# Altium project DCFv2.PrjPcb
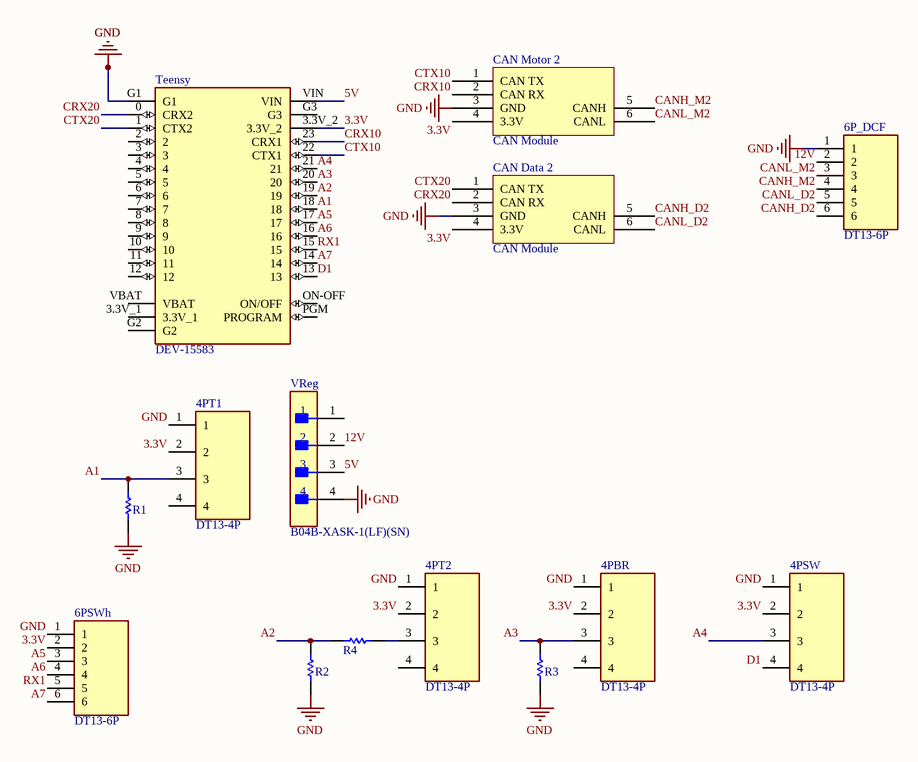
[diagram p0: DCFv2.SchDoc]
1 sheet, 14 parts. Net scope: global (net labels, ports and power ports of the same name join across sheets).
Board file: DCFv2.PcbDoc

## Sheet DCFv2.SchDoc
size A; SheetNumber: 1; SheetTotal: 1

### Parts
4PBR  DT13-4P  [TE_DT13-4P]
4PSW  DT13-4P  [TE_DT13-4P]
4PT1  DT13-4P  [TE_DT13-4P]
4PT2  DT13-4P  [TE_DT13-4P]
6P_DCF  DT13-6P  [TE_DT13-6P]
6PSWh  DT13-6P  [TE_DT13-6P]
CAN_Data_2  CAN Module  [CAN Module-Footprint-1]
CAN_Motor_2  CAN Module  [CAN Module-Footprint-1]
R1  MFR-25FBF5210K  [RESA60-630X240]  (value not drawn)
R2  MFR-25FBF5210K  [RESA60-630X240]  (value not drawn)
R3  MFR-25FBF5210K  [RESA60-630X240]  (value not drawn)
R4  MFR-25FBF5210K  [RESA60-630X240]  (value not drawn)
Teensy  DEV-15583  [MODULE_DEV-15583]
VReg  B04B-XASK-1(LF)(SN)  [FP-B04B-XASK-1_LF_SN-MFG]

### Nets
GND: 4PBR.1 4PSW.1 4PT1.1 4PT2.1 6P_DCF.1 6PSWh.1 CAN_Data_2.3(GND) CAN_Motor_2.3(GND) R1.1 R2.1 R3.1 Teensy.G1 VReg.4
3.3V: 4PBR.2 4PSW.2 4PT1.2 4PT2.2 6PSWh.2 CAN_Data_2.4(3.3V) CAN_Motor_2.4(3.3V) Teensy.3.3V_2
5V: Teensy.VIN VReg.3
12V: 6P_DCF.2 VReg.2
A1: 4PT1.3 R1.2 Teensy.18
A2: R2.2 R4.2 Teensy.19
A3: 4PBR.3 R3.2 Teensy.20
A4: 4PSW.3 Teensy.21
A5: 6PSWh.3 Teensy.17
A6: 6PSWh.4 Teensy.16
A7: 6PSWh.6 Teensy.14
CANH_D2: 6P_DCF.6 CAN_Data_2.5(CANH)
CANH_M2: 6P_DCF.4 CAN_Motor_2.5(CANH)
CANL_D2: 6P_DCF.5 CAN_Data_2.6(CANL)
CANL_M2: 6P_DCF.3 CAN_Motor_2.6(CANL)
CRX10: CAN_Motor_2.2(CAN_RX) Teensy.23(CRX1)
CRX20: CAN_Data_2.2(CAN_RX) Teensy.0(CRX2)
CTX10: CAN_Motor_2.1(CAN_TX) Teensy.22(CTX1)
CTX20: CAN_Data_2.1(CAN_TX) Teensy.1(CTX2)
D1: 4PSW.4 Teensy.13
RX1: 6PSWh.5 Teensy.15
Net4PT2_3: 4PT2.3 R4.1

Not connected (* = marked no-connect by the designer): 4PBR 4; 4PT1 4; 4PT2 4; Teensy 2 3 3.3V_1 4 5 6 7 8 9 10 11 12 G2 G3 ON-OFF(ON/OFF) PGM(PROGRAM) VBAT; VReg 1

### Library data of the parts
4PBR 4PSW 4PT1 4PT2 = DT13-4P: DT13 Series, 4.44mm Pitch 4 Way 2 Row Right Angle PCB Header, Solder Termination; MF: TE Connectivity; SnapEDA_Link: https://www.snapeda.com/parts/DT13-4P/TE%20Connectivity%20Deutsch%20Connectors/view-part/2708791/?ref=snap; MP: DT13-4P; TE_purchase_URL: https://www.te.com/usa-en/product-DT13-4P.html?te_bu=Cor&te_type=disp&te_campaign=seda_glo_cor-seda-global-disp-prtnr-fy19-seda-model-bom-cta_sma-317_1&elqCampaignId=32493; Availability: Unavailable; Value: *; Price: None; Package: None
6P_DCF 6PSWh = DT13-6P: DT13 Series, 4.44mm Pitch 6 Way 2 Row Right Angle PCB Header, Solder Termination; MF: TE Connectivity; DigiKey-Purchase-URL: https://snapeda.com/shop?store=DigiKey&id=1897474; Value: *; SnapEDA_Link: https://www.snapeda.com/parts/DT13-6P/TE%20Connectivity%20Deutsch%20Connectors/view-part/1897474/?ref=snap; EU_RoHS_Compliance: Compliant; Availability: Unavailable; Price: None; Package: None; MP: DT13-6P
CAN_Data_2 CAN_Motor_2 = CMP-00030-00003-1: CAN waveshare
R1-R4 = CMP-1659-00074-2: Axial Resistor, 10 KOhm, +/- 1%, 0.25 W, -55 to 155 degC, 2-Pin THD, RoHS, Bulk; Manufacturer: Yageo; Temperature Coefficient: 100ppm\/degreesC; Voltage Rating: 250V; Voltage Rating (DC): 200V; Resistance: 10KOhm; Max Power Dissipation: 250mW; Datasheet URL: http://www.yageo.com/documents/recent/Yageo%20LR_MFR_2013.pdf; Packaging: Bulk; RoHSCompliant: True; Mount: ThroughHole; Package Reference: MFR-25; Termination: Axial; Composition: MetalFilm; Number of Terminations: 2; Package Quantity: 200; Mounting Technology: ThroughHole; Length: 0.248inch; Max Operating Temperature: 155degC; Min Operating Temperature: -55degC; Datasheet Version: 04/2013; Lead Free: LeadFree; Manufacturer URL: http://www.yageo.com/; Tolerance: 1%; Power Rating: 250mW; Package Description: 2-Pin Axial Lead, Dia 2.4 mm, Body Length 6.3 mm; Military Standard: Not; Case\/Package: Axial
Teensy = DEV-15583: RT1062 Teensy 4.0 i.MX ARMÂ® CortexÂ®-M7 MPU Embedded Evaluation Board; MF: SparkFun Electronics; Value: *; Package: None; Digi-Key_Part_Number: 1568-DEV-15583-ND; Digi-Key_Purchase_URL: https://www.digikey.com/product-detail/en/sparkfun-electronics/DEV-15583/1568-DEV-15583-ND/10384551?utm_source=snapeda&utm_medium=aggregator&utm_campaign=symbol; MP: DEV-15583; SnapEDA_Link: https://www.snapeda.com/parts/DEV-15583/SparkFun%20Electronics/view-part/4001229/?ref=snap
VReg = CMP-17439-000018-1: CONN HEADER VERT 4POS 2.5MM; Manufacturer: JST; Current Rating: 3A; Voltage Rating: 250V; Conn Orientation: Straight; Conn Gender: Male; Number Of Contacts: 4; ComponentLink2Description: Datasheet; Package: B04B-XASK-1(LF)(SN); Octopart: https://octopart.com/b04b-xask-1%28lf%29%28sn%29-jst-3990149; Pitch: 2.5mm; Device Class L1: Connectors; RoHS: TRUE; Device Class L3: unset; Manufacturer Part Number: B04B-XASK-1(LF)(SN); Temperature Range High: +85°C; Height: 8.8mm; Lead Free: Yes; Category: Conn; Temperature: -25°C to +85°C; Digikey Description: CONN HEADER VERT 4POS 2.5MM; Temperature Range Low: -25°C; ComponentLink2URL: http://www.jst-mfg.com/product/pdf/eng/eXA1.pdf; Contact Material: Tin,Copper; Device Class L2: Headers and Wire Housings; Automotive: No; Number Of Rows: 1